# EAGLE design cociclo_04 (EAGLE 8.6.0)
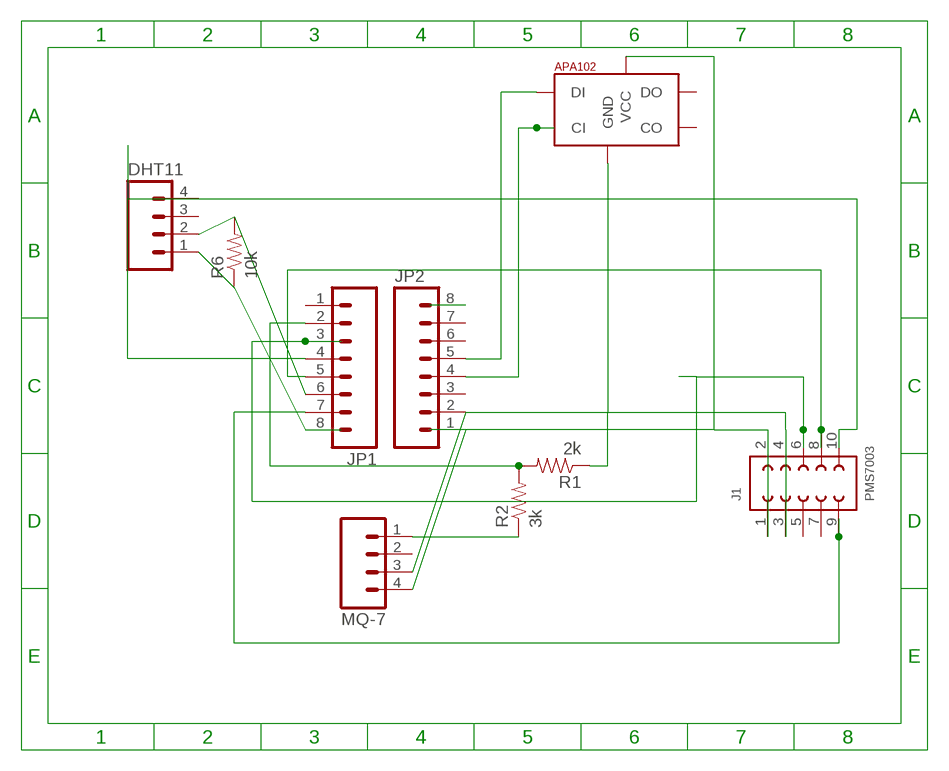
[diagram p0: schematic, sheet 1]

## Parts
DHT11  M04PTH  [1X04]
J1  PMS7003  621X1021021  [621X1021021]
JP1  M08  [1X08_ROUND]
JP2  M08  [1X08_ROUND]
LED  APA1025050  [APA102_5050]
MQ-7  M04PTH  [1X04]
R1  2k  RESISTOR1206  [1206]
R2  3k  RESISTOR1206  [1206]
R6  10k  RESISTOR1206  [1206]

## Nets
5RESET: J1.6 JP1.3
7RX: J1.8 JP1.5
9TX: J1.10 JP1.4
10SET: J1.9 JP1.7
+5V: J1.1 J1.2 JP2.1 LED.1(VCC) MQ-7.4
ADC: JP1.2 R1.2 R2.2
CH_PD: DHT11.1 JP1.8 R6.1
D2: JP2.5 LED.4(DI)
GND: DHT11.4 J1.3 J1.4 JP2.2 LED.6(GND) MQ-7.3 R1.1
GPIO14: DHT11.2 JP1.6 R6.2
MQ7ANALOG: MQ-7.1 R2.1
N$10: JP2.4 LED.5(CI)
N$14: JP2.8
Unconnected: DHT11.3 J1.5 J1.7 JP1.1 JP2.3 JP2.6 JP2.7 LED.2(CO) LED.3(DO) MQ-7.2

## Library data of the parts
DHT11 MQ-7 = SparkFun-Connectors:M04: Header 4 Standard 4-pin 0.1" header. Use with straight break away headers (SKU : PRT-00116), right angle break away headers (PRT-00553), swiss pins (PRT-00743), machine pins (PRT-00117), and female headers (PRT-00115). Molex polarized connector foot print use with SKU : PRT-08231 with associated crimp pins and housings. 1MM SMD Version SKU: PRT-10208
J1 = Board-to-Board (rev18a):621X1021021: WR-PHD 1.27mm Dual SMT Pin Header H=3.80 mm, 10 Pins=>Code : Con_BTB_PHD_1.27_2_621x1021021(Packaging:x = 0: Tube x = 3: Tape & Reel with Cap) <http://katalog.we-online.de/media/thumbs2/eican/thb_Con_BTB_PHD_1.27_2_6210xx21021_pf2.jpg> 6210xx21021 Details see: http://katalog.we-online.de/en/em/621_0xx_210_21 6213xx21021 Details see: http://katalog.we-online.de/en/em/PHD_1_27_SMT_DUAL_PIN_HEADER_REEL_6213XX21021 2014 (C) Würth Elektronik
JP1 JP2 = SparkFun-Connectors:M08: Header 8 Standard 8-pin 0.1" header. Use with straight break away headers (SKU : PRT-00116), right angle break away headers (PRT-00553), swiss pins (PRT-00743), machine pins (PRT-00117), and female headers (PRT-00115).
LED = jos-ph:APA102: APA102C 5050 RGB LED -- Adafruit DotStar Single LED Pixel Product Page: https://www.adafruit.com/products/2343 Datasheet: https://cdn-shop.adafruit.com/product-files/2343/APA102C.pdf
R1 R2 R6 = SparkFun-Resistors:RESISTOR: Resistor Basic schematic elements and footprints for 0603, 1206, and PTH resistors.

## Board
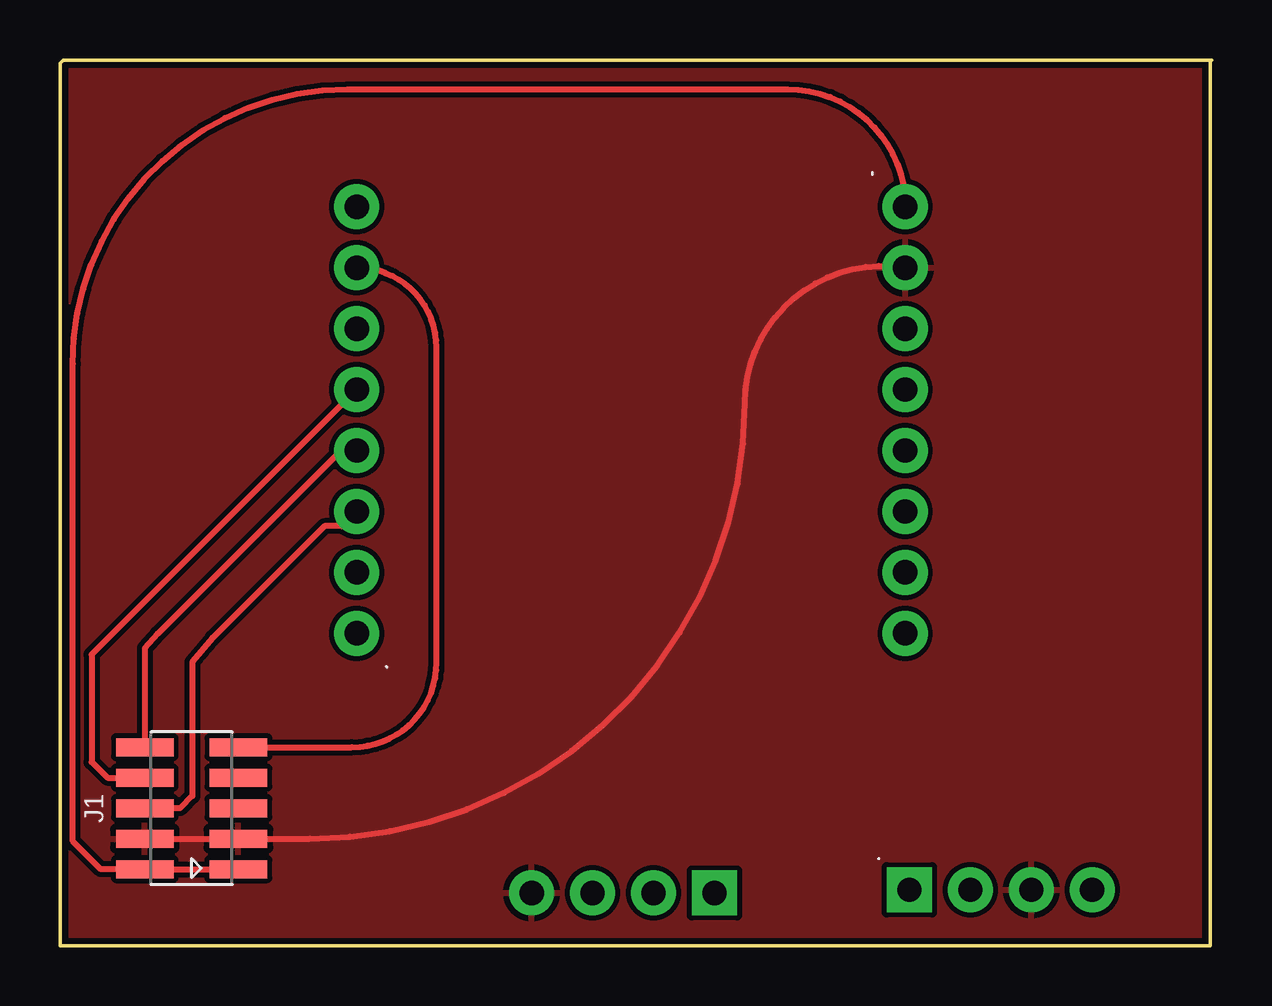
[diagram p1: board, top side]
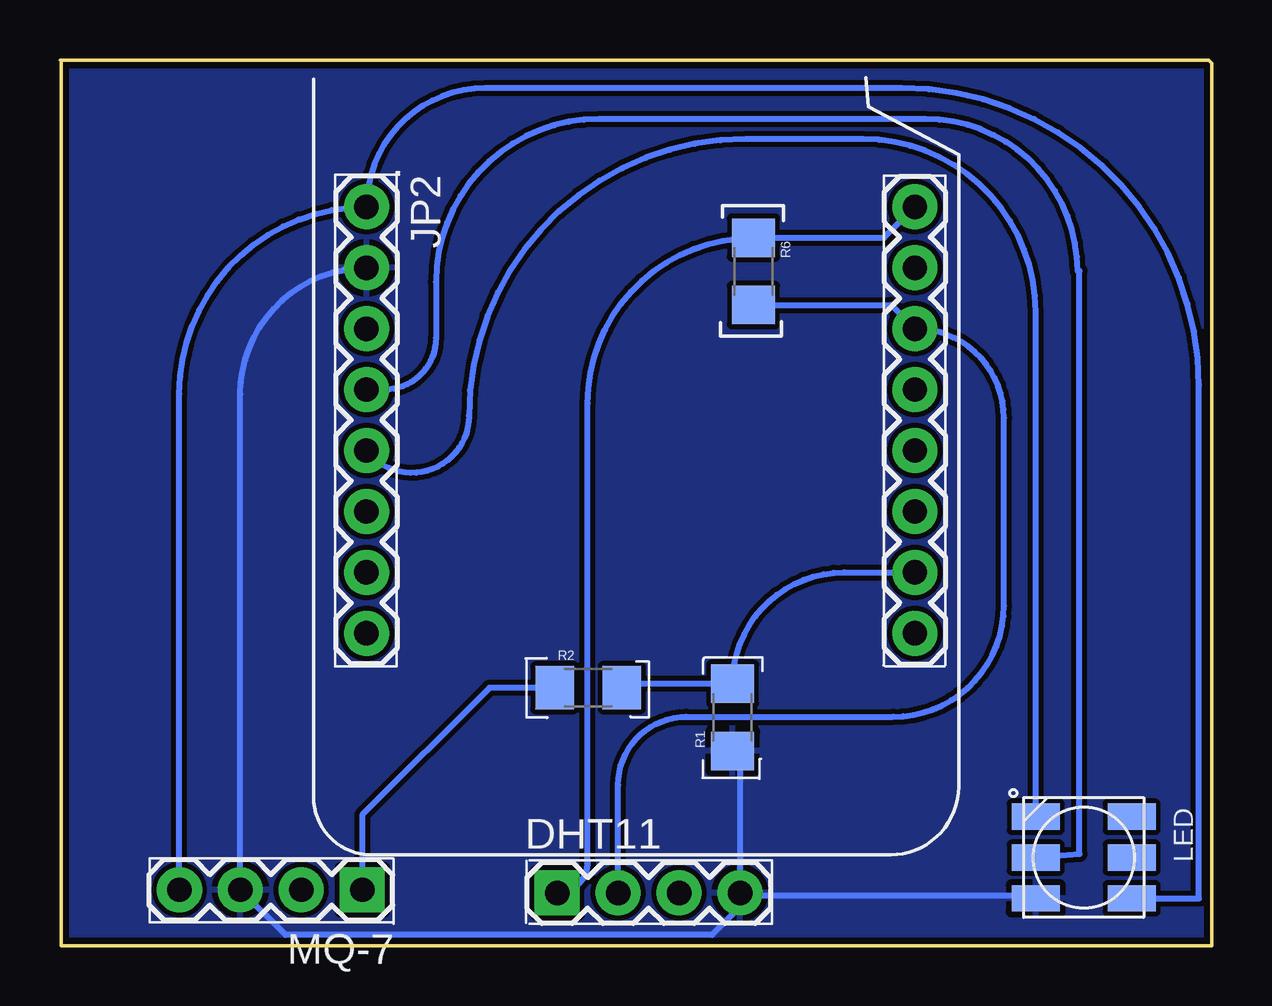
[diagram p2: board, bottom side, seen from below]

Size 48.01 x 36.93 mm. Coordinates in mm from the lower left corner, seen from the top.
Outline: 47.96,36.93 47.96,0 0,0 0,36.8 0.13,36.93 48.01,36.93
Copper layers (1*16): Top 0.035mm / dielectric 1.5mm / Bottom 0.035mm
Design rules "adafruit *": minimum track width 10mil, minimum drill 15.5mil, track to track 8mil, track to pad 8mil, pad to pad 8mil, via to via 8mil, smd to smd 8mil, copper to edge 10mil, drill to drill 8mil, minimum pad ring 10mil, minimum via ring 8mil, stop-mask expansion 2mil, vias tented up to drill 20mil, thermal gap 10mil

### Footprints (pad centres in the part's own frame; a part is rotated, then mirrored left to right if it is on the bottom)
1X04 = drill 1.016 pad 1.88 square: 1 0,0 | drill 1.016 pad 1.88: 2 2.54,0; 3 5.08,0; 4 7.62,0
621X1021021 = smd 0.75 x 2.4: 1 -2.54,-1.95; 2 -2.54,1.95; 3 -1.27,-1.95; 4 -1.27,1.95; 5 0,-1.95; 6 0,1.95; 7 1.27,-1.95; 8 1.27,1.95; 9 2.54,-1.95; 10 2.54,1.95
1X08_ROUND = drill 1.016 pad 1.88: 1 0,0; 2 2.54,0; 3 5.08,0; 4 7.62,0; 5 10.16,0; 6 12.7,0; 7 15.24,0; 8 17.78,0
APA102_5050 = smd 2 x 1.1: 1 2,-1.7; 2 2,0; 3 2,1.7; 4 -2,1.7; 5 -2,0; 6 -2,-1.7
1206 = smd 1.6 x 1.8: 1 -1.4,0; 2 1.4,0

### Placement (x,y rotation side)
DHT11  27.28,2.21 0 bottom
J1  5.49,5.74 90 top
JP1  12.37,13.03 90 bottom
JP2  35.23,30.81 270 bottom
LED  5.33,3.68 0 bottom
MQ-7  35.41,2.34 180 bottom
R1  19.97,9.52 90 bottom
R2  25.99,10.76 0 bottom
R6  19.1,28.12 270 bottom

### Tracks (layer width: path | path; a pad name or v marks a point on that pad's centre or on a via)
5RESET
  Top 0.254: JP1.3 11.76,17.5 11.02,17.5 6.36,12.84 5.51,11.83 5.51,6.25 5,5.74 J1.6
7RX
  Top 0.254: JP1.5 1.32,12.14 1.32,7.67 1.98,7.01 J1.8
9TX
  Top 0.254: JP1.4 11.71,20.65 4.07,13.01 3.54,12.4 J1.10
10SET
  Top 0.254: J1.9 12.17,8.28 arc90 15.7,11.81 15.7,24.94 arc90 JP1.7
+5V
  Top 0.254: J1.1 J1.2 1.7,3.2 0.53,4.37 0.53,24.26 arc-90 11.99,35.71 30.33,35.71 arc-90 JP2.1
  Bottom 0.254: MQ-7.4 43.03,23.01 arc90 JP2.1 arc90 30.28,35.76 12.93,35.76 arc90 0.53,23.37 0.53,1.98 LED.1
ADC
  Bottom 0.254: 24.68,10.88 24.64,10.93 R1.2 arc90 15.32,15.57 JP1.2
  Bottom 0.61: 24.56,11 arc90 24.68,10.88 24.68,11.38 arc90 R2.2
CH_PD
  Bottom 0.254: JP1.8 13.66,29.52 R6.1 arc-90 26.01,22.61 26.01,3.48 arc90 DHT11.1
  Bottom 0.61: JP1.8 arc-90 11.98,30.42
D2
  Bottom 0.254: LED.4 7.33,26.44 arc-90 14.53,33.63 19.43,33.63 arc-90 30.96,22.1 arc143 JP2.5
GND
  Top 0.254: J1.4 J1.3 10.41,4.47 arc90 28.55,22.61 arc-99 JP2.2
  Bottom 0.254: 35.2,28.27 arc-90 40.49,22.99 MQ-7.3 38.61,0.46 20.83,0.46 19.66,1.63 19.66,2.08 | 19.66,2.08 DHT11.4 19.66,7.82 arc-90 R1.1 | LED.6 arc-90 7.43,2.08 19.66,2.08
  Bottom 0.61: 35.2,28.27 JP2.2
  pour Bottom: -0.04,-0.01 0.14,37.01 47.94,36.96 47.97,-0.09
  pour Top: -0.06,0.03 -0.03,36.98 47.92,36.86 47.94,0.05
GPIO14
  Bottom 0.254: R6.2 13.36,26.72 JP1.6 arc90 8.66,22.02 8.66,14.17 arc90 13.28,9.55 21.89,9.55 arc-90 24.74,6.71 DHT11.2
MQ7ANALOG
  Bottom 0.254: R2.1 30.1,10.76 35.41,5.46 MQ-7.1
N$10
  Bottom 0.254: LED.5 5.51,3.84 5.51,28.14 5.59,28.14 arc-90 11.91,34.47 25.55,34.47 arc-90 32.33,27.69 32.33,25.35 arc90 34.49,23.19 JP2.4

### Text on the board
uqam: v0.3
noms_b: 3V3 | V+ | D8 | G | D7 | 10k | D6 | D3 | D5 | D2 | D0 | D1 | A0 | RST | 2k | 3k | G | D7 | 3V | A0 | G | V+ | DHT11 | MQ-7
192bmp: /Users/uqam/Desktop/ohanda_logo.bmp
noms_t: G | DHT11 | D7 | 3V | A0 | D2 | D1 | SPKR | G | V+ | D2 | DEL | D3 | D7 | A0 | G | G | 3V3 | V+ | V+ | MQ-7 | V+ | V+ | G | G | PWR
200bmp: /Users/uqam/Desktop/Artengine_logo_petit_n_b.bmp | /Users/uqam/Desktop/cociclo_logo.bmp